# Altium schematic sheet Title.SchDoc: Title
size Tabloid; Revision: A; ProjectTitle: HDU: Hub/Display Unit
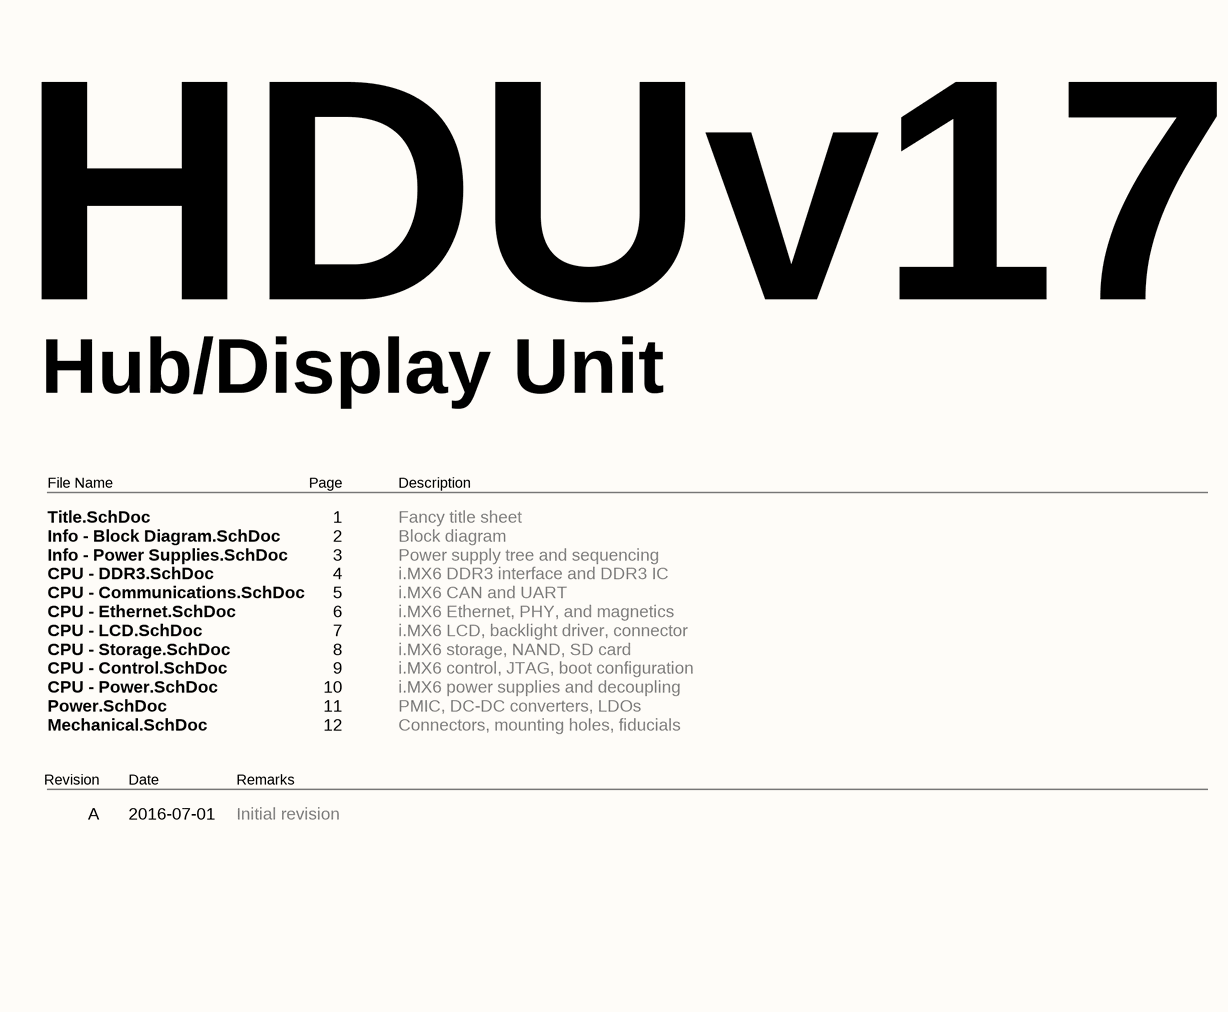
[diagram p0: Title.SchDoc]

## Notes on the sheet
- HDUv17
- Hub/Display Unit
- File Name
- Page
- Description
- Title.SchDoc
  Info - Block Diagram.SchDoc
  Info - Power Supplies.SchDoc
  CPU - DDR3.SchDoc
  CPU - Communications.SchDoc
  CPU - Ethernet.SchDoc
  CPU - LCD.SchDoc
  CPU - Storage.SchDoc
  CPU - Control.SchDoc
  CPU - Power.SchDoc
  Power.SchDoc
  Mechanical.SchDoc
- 1
  2
  3
  4
  5
  6
  7
  8
  9
  10
  11
  12
- Fancy title sheet
  Block diagram
  Power supply tree and sequencing
  i.MX6 DDR3 interface and DDR3 IC
  i.MX6 CAN and UART
  i.MX6 Ethernet, PHY, and magnetics
  i.MX6 LCD, backlight driver, connector
  i.MX6 storage, NAND, SD card
  i.MX6 control, JTAG, boot configuration
  i.MX6 power supplies and decoupling
  PMIC, DC-DC converters, LDOs
  Connectors, mounting holes, fiducials
- Revision
- Date
- Remarks
- Initial revision
- A
- 2016-07-01
- Date:
- Revision:
- Sheet:
- /